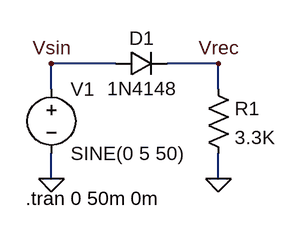
[diagram p0: schematic HalfRectifier.asc]
HalfRectifier.asc, the LTspice schematic file:
Version 4
SHEET 1 880 680
WIRE -160 32 -240 32
WIRE -32 32 -96 32
WIRE -240 64 -240 32
WIRE -32 64 -32 32
WIRE -240 176 -240 144
WIRE -32 176 -32 144
FLAG -32 176 0
FLAG -240 176 0
FLAG -240 32 Vsin
FLAG -32 32 Vrec
SYMBOL res -48 48 R0
SYMATTR InstName R1
SYMATTR Value 3.3K
SYMBOL voltage -240 48 R0
WINDOW 123 0 0 Left 0
WINDOW 39 0 0 Left 0
SYMATTR InstName V1
SYMATTR Value SINE(0 5 50)
SYMBOL diode -160 48 R270
WINDOW 0 32 32 VTop 2
WINDOW 3 0 32 VBottom 2
SYMATTR InstName D1
SYMATTR Value 1N4148
TEXT -272 200 Left 2 !.tran 0 50m 0m

The netlist it stands for:
* HalfRectifier.asc
R1 Vrec 0 3.3K
V1 Vsin 0 SINE(0 5 50)
D1 Vsin Vrec 1N4148
.model D D
.lib standard.dio
.tran 0 50m 0m
.backanno
.end

* Results of the author's LTspice run, read from the files saved beside the schematic
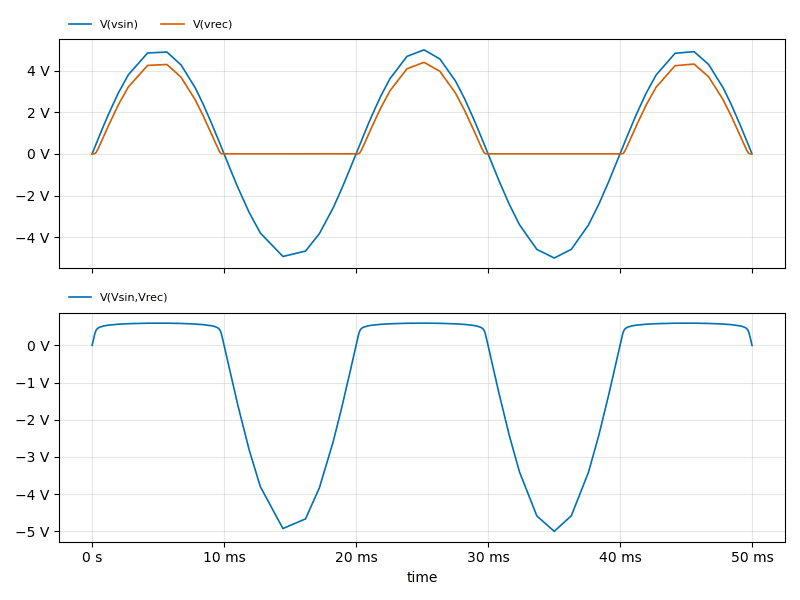
[diagram p1: Transient Analysis of HalfRectifier.asc, plotted from the saved traces]
* Transient Analysis, 1 run:
*   V(vsin): min -5 V, max 4.994 V, average 633.3 mV, rms 3.504 V, last 0 V
*   V(vrec): min -27.42 µV, max 4.396 V, average 1.562 V, rms 2.317 V, last -21.41 µV
*   V(Vsin,Vrec): min -5 V, max 598.2 mV, average -928.5 mV, rms 2.256 V, last 21.41 µV